# EAGLE design BattleBitsManual (EAGLE 9.3.2)
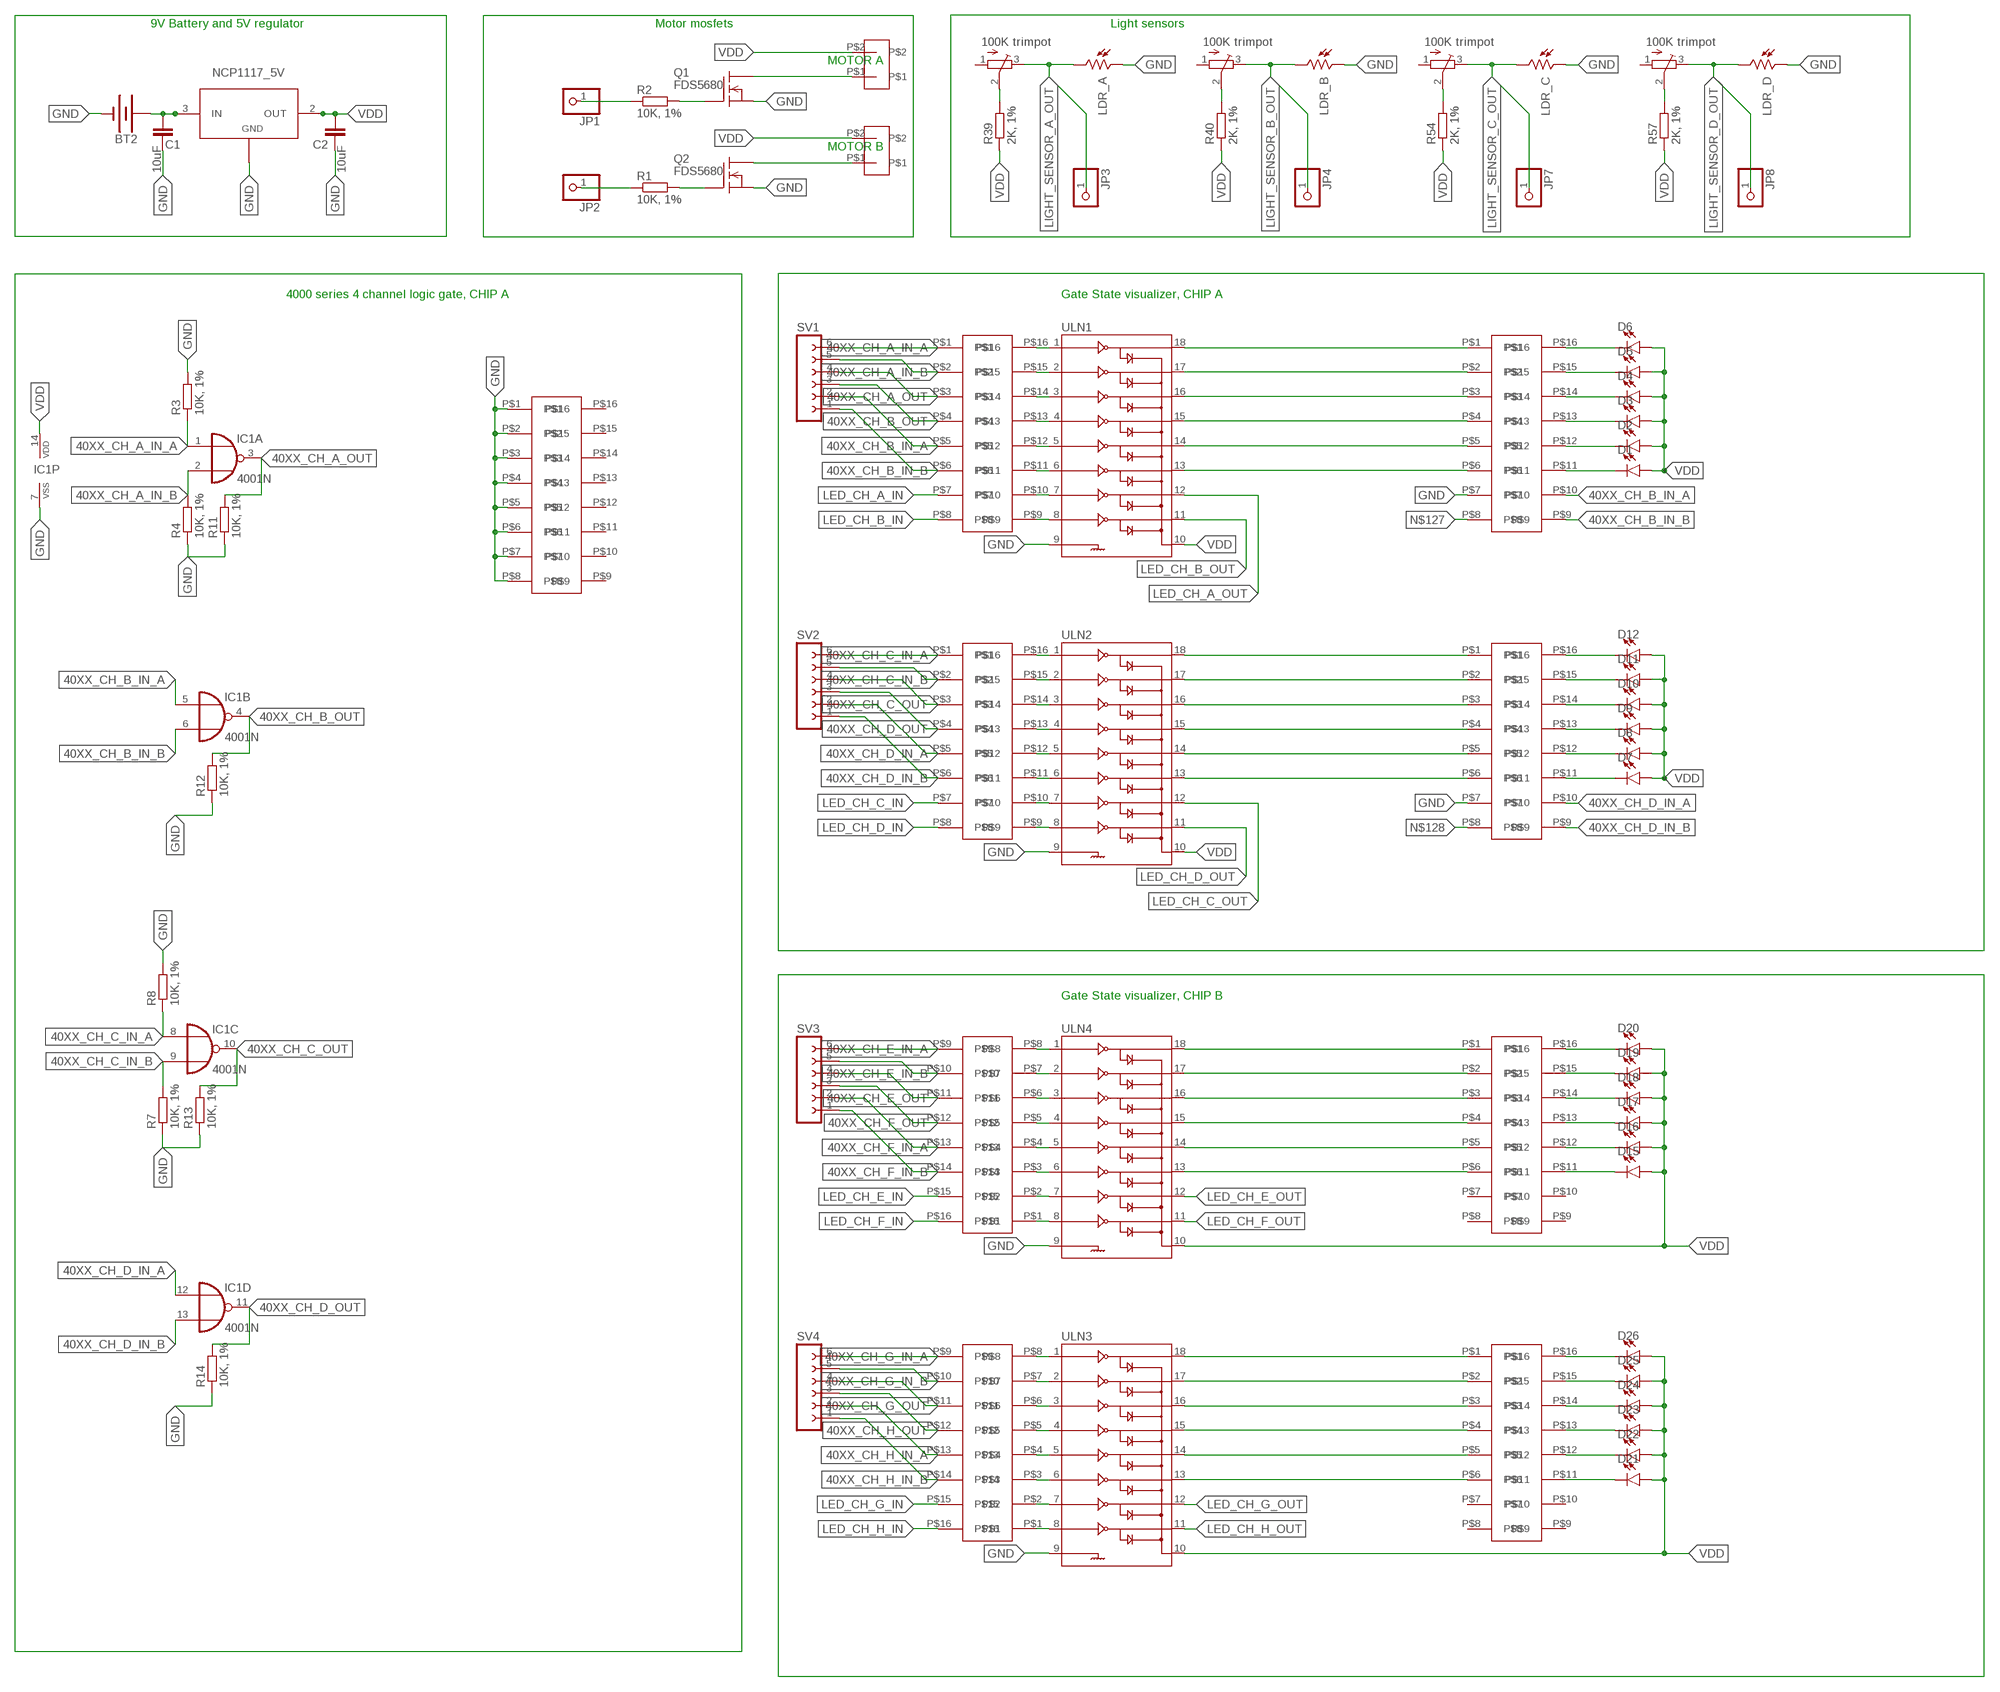
[diagram p0: schematic, sheet 1, part 1 of 3]
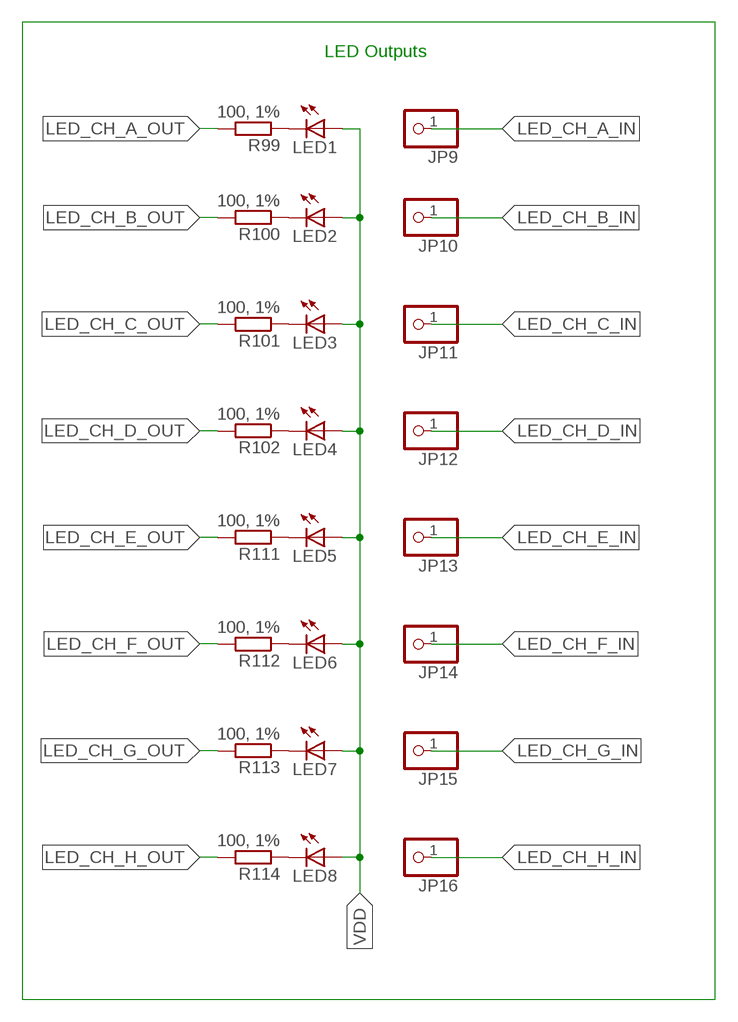
[diagram p1: schematic, sheet 1, part 2 of 3]
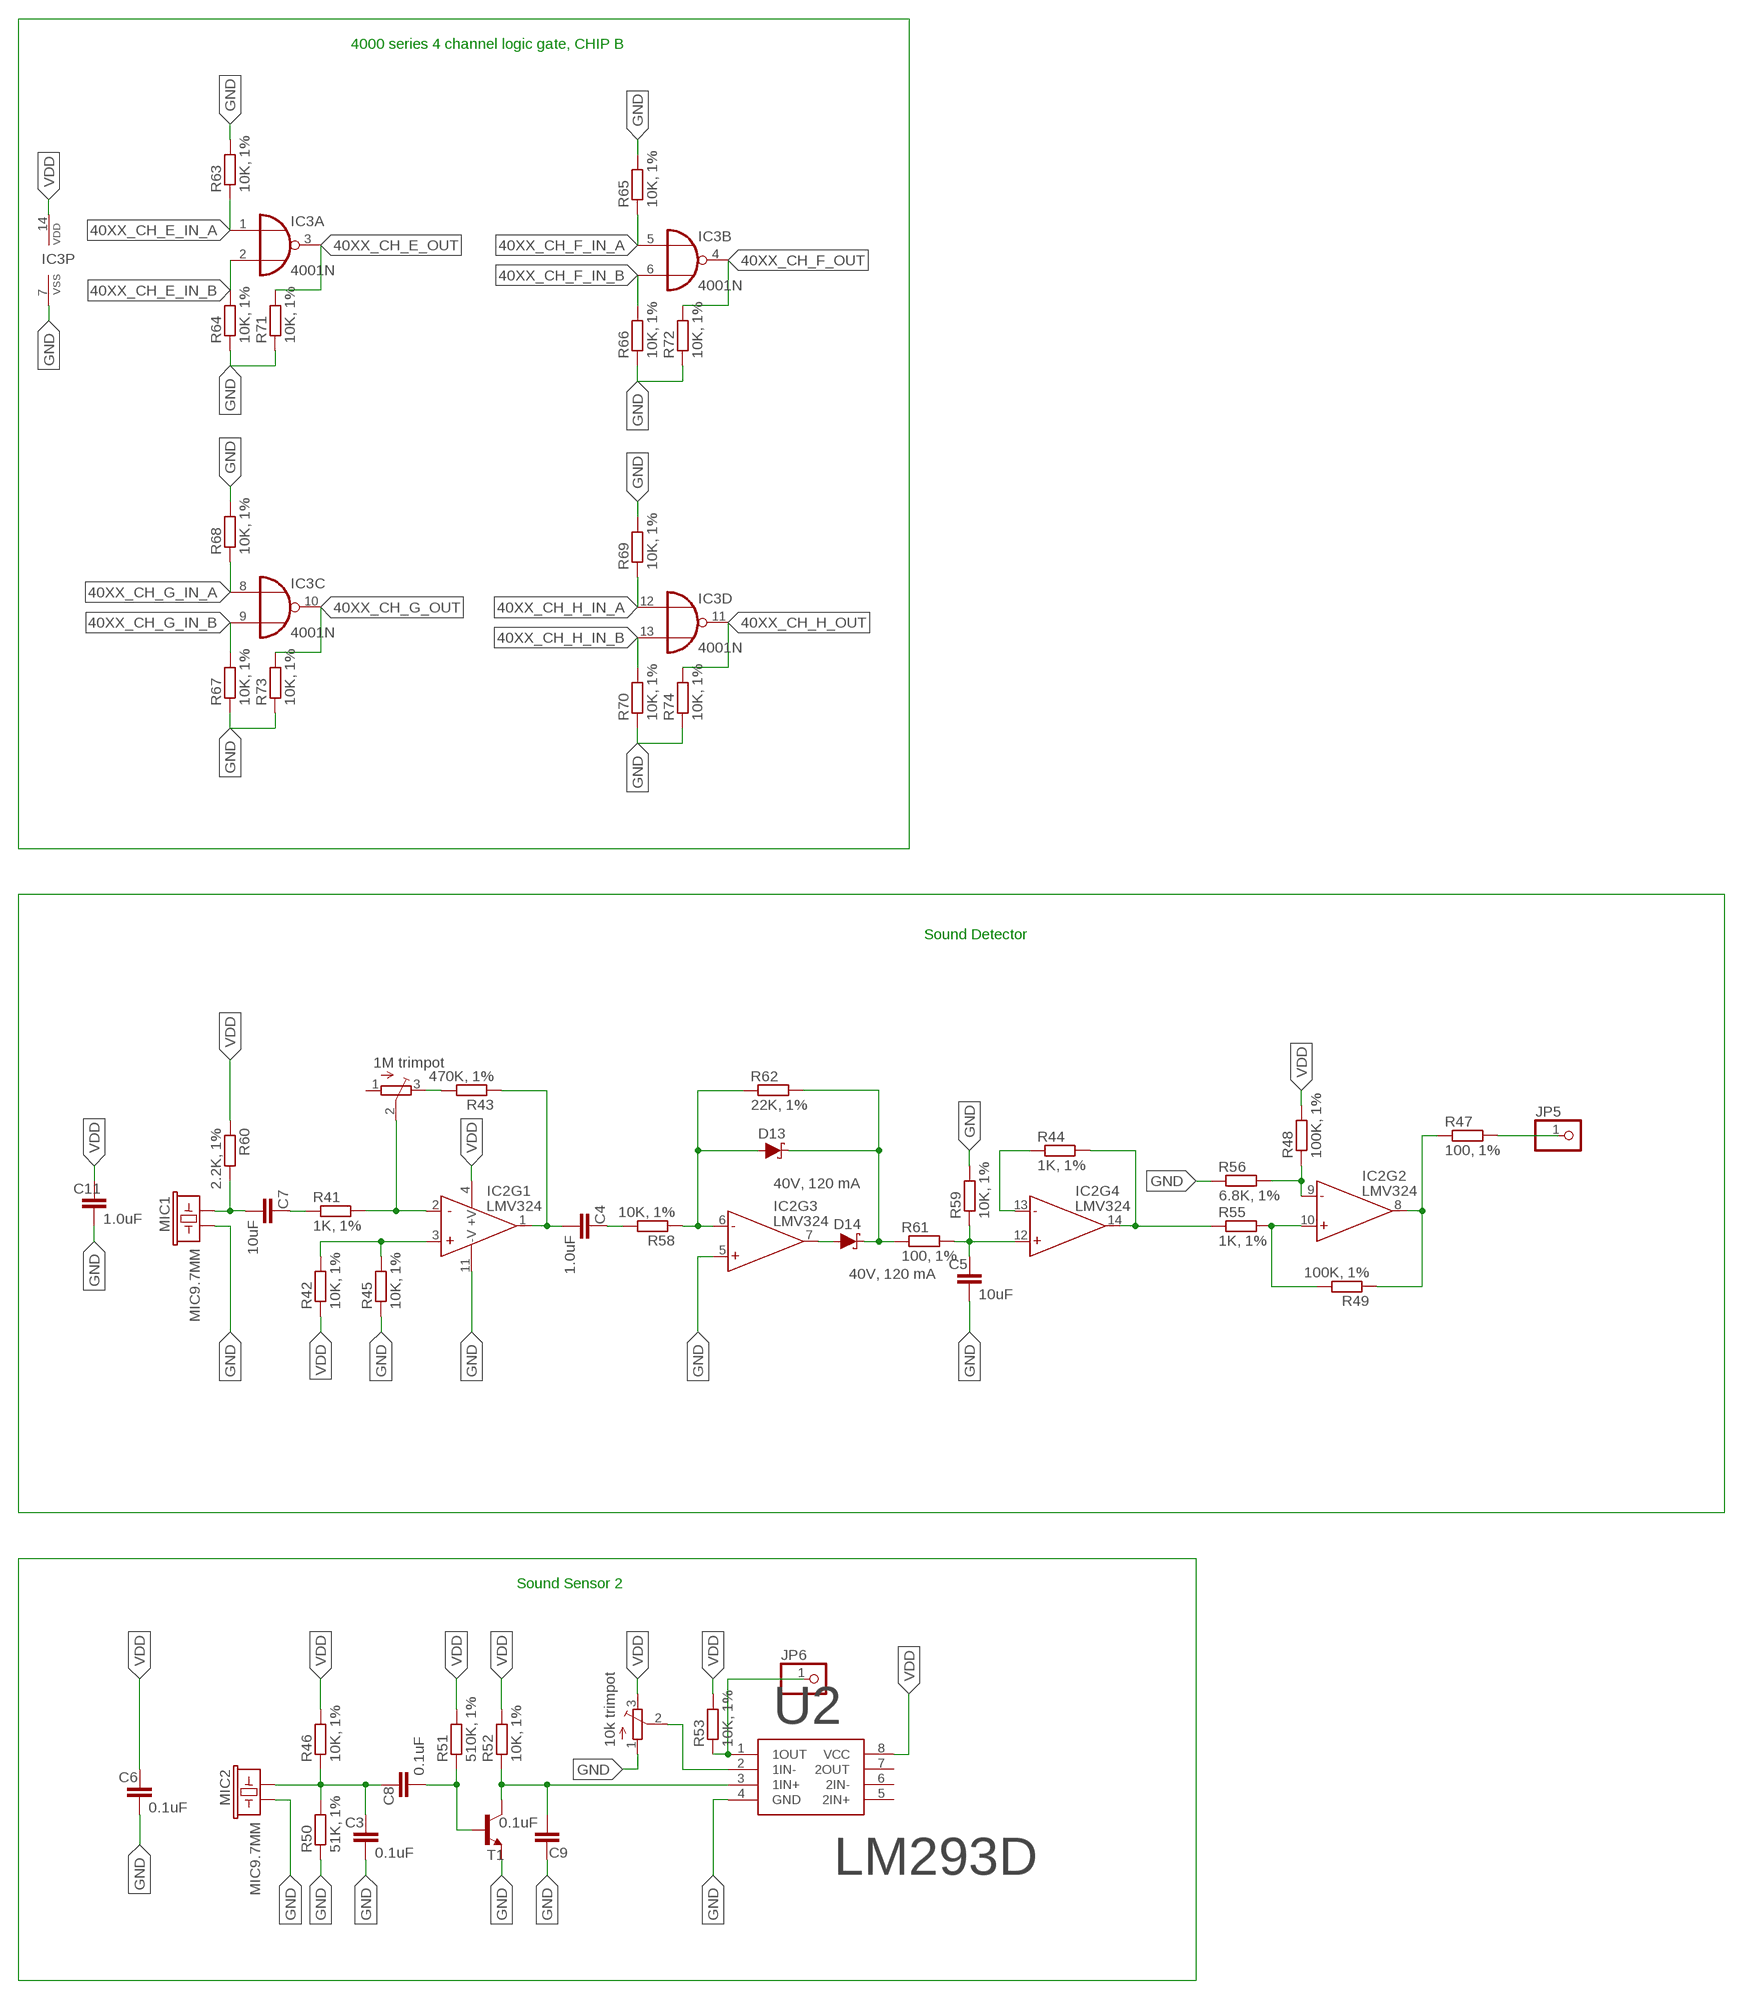
[diagram p2: schematic, sheet 1, part 3 of 3]

## Parts
BT2  BATTERY-9V  [BATTCON_9V]
C1  10uF  C-EUC3216  [C3216]
C2  10uF  C-EUC3216  [C3216]
C3  0.1uF  C-EUC3216  [C3216]
C4  1.0uF  C-EUC3216  [C3216]
C5  10uF  C-EUC3216  [C3216]
C6  0.1uF  C-EUC3216  [C3216]
C7  10uF  C-EUC3216  [C3216]
C8  0.1uF  C-EUC3216  [C3216]
C9  0.1uF  C-EUC3216  [C3216]
C11  1.0uF  C-EUC3216  [C3216]
D1  LED1206  [LED-1206]
D2  LED1206  [LED-1206]
D3  LED1206  [LED-1206]
D4  LED1206  [LED-1206]
D5  LED1206  [LED-1206]
D6  LED1206  [LED-1206]
D7  LED1206  [LED-1206]
D8  LED1206  [LED-1206]
D9  LED1206  [LED-1206]
D10  LED1206  [LED-1206]
D11  LED1206  [LED-1206]
D12  LED1206  [LED-1206]
D13  40V, 120 mA  DIODE-SCHOTTKY-ZLLS500  [SOT23-3]
D14  40V, 120 mA  DIODE-SCHOTTKY-ZLLS500  [SOT23-3]
D15  LED1206  [LED-1206]
D16  LED1206  [LED-1206]
D17  LED1206  [LED-1206]
D18  LED1206  [LED-1206]
D19  LED1206  [LED-1206]
D20  LED1206  [LED-1206]
D21  LED1206  [LED-1206]
D22  LED1206  [LED-1206]
D23  LED1206  [LED-1206]
D24  LED1206  [LED-1206]
D25  LED1206  [LED-1206]
D26  LED1206  [LED-1206]
IC1  4001N  [DIL14]
IC2  LMV324  [SO014]
IC3  4001N  [DIL14]
JP1  PINHD-1X1  [1X01]
JP2  PINHD-1X1  [1X01]
JP3  PINHD-1X1  [1X01]
JP4  PINHD-1X1  [1X01]
JP5  PINHD-1X1  [1X01]
JP6  PINHD-1X1  [1X01]
JP7  PINHD-1X1  [1X01]
JP8  PINHD-1X1  [1X01]
JP9  PINHD-1X1  [1X01]
JP10  PINHD-1X1  [1X01]
JP11  PINHD-1X1  [1X01]
JP12  PINHD-1X1  [1X01]
JP13  PINHD-1X1  [1X01]
JP14  PINHD-1X1  [1X01]
JP15  PINHD-1X1  [1X01]
JP16  PINHD-1X1  [1X01]
LDR_A  V1060_21  [TO-5_V10]
LDR_B  V1060_21  [TO-5_V10]
LDR_C  V1060_21  [TO-5_V10]
LDR_D  V1060_21  [TO-5_V10]
LED1  LED5MM  [LED5MM]
LED2  LED5MM  [LED5MM]
LED3  LED5MM  [LED5MM]
LED4  LED5MM  [LED5MM]
LED5  LED5MM  [LED5MM]
LED6  LED5MM  [LED5MM]
LED7  LED5MM  [LED5MM]
LED8  LED5MM  [LED5MM]
MIC1  MIC9.7MM  [MIC-9.7MM]
MIC2  MIC9.7MM  [MIC-9.7MM]
Q1  FDS5680  [SO-8]
Q2  FDS5680  [SO-8]
R1  10K, 1%  R-EU_R3216  [R3216]
R2  10K, 1%  R-EU_R3216  [R3216]
R3  10K, 1%  R-EU_R3216  [R3216]
R4  10K, 1%  R-EU_R3216  [R3216]
R7  10K, 1%  R-EU_R3216  [R3216]
R8  10K, 1%  R-EU_R3216  [R3216]
R11  10K, 1%  R-EU_R3216  [R3216]
R12  10K, 1%  R-EU_R3216  [R3216]
R13  10K, 1%  R-EU_R3216  [R3216]
R14  10K, 1%  R-EU_R3216  [R3216]
R39  2K, 1%  R-EU_R3216  [R3216]
R40  2K, 1%  R-EU_R3216  [R3216]
R41  1K, 1%  R-EU_R3216  [R3216]
R42  10K, 1%  R-EU_R3216  [R3216]
R43  470K, 1%  R-EU_R3216  [R3216]
R44  1K, 1%  R-EU_R3216  [R3216]
R45  10K, 1%  R-EU_R3216  [R3216]
R46  10K, 1%  R-EU_R3216  [R3216]
R47  100, 1%  R-EU_R3216  [R3216]
R48  100K, 1%  R-EU_R3216  [R3216]
R49  100K, 1%  R-EU_R3216  [R3216]
R50  51K, 1%  R-EU_R3216  [R3216]
R51  510K, 1%  R-EU_R3216  [R3216]
R52  10K, 1%  R-EU_R3216  [R3216]
R53  10K, 1%  R-EU_R3216  [R3216]
R54  2K, 1%  R-EU_R3216  [R3216]
R55  1K, 1%  R-EU_R3216  [R3216]
R56  6.8K, 1%  R-EU_R3216  [R3216]
R57  2K, 1%  R-EU_R3216  [R3216]
R58  10K, 1%  R-EU_R3216  [R3216]
R59  10K, 1%  R-EU_R3216  [R3216]
R60  2.2K, 1%  R-EU_R3216  [R3216]
R61  100, 1%  R-EU_R3216  [R3216]
R62  22K, 1%  R-EU_R3216  [R3216]
R63  10K, 1%  R-EU_R3216  [R3216]
R64  10K, 1%  R-EU_R3216  [R3216]
R65  10K, 1%  R-EU_R3216  [R3216]
R66  10K, 1%  R-EU_R3216  [R3216]
R67  10K, 1%  R-EU_R3216  [R3216]
R68  10K, 1%  R-EU_R3216  [R3216]
R69  10K, 1%  R-EU_R3216  [R3216]
R70  10K, 1%  R-EU_R3216  [R3216]
R71  10K, 1%  R-EU_R3216  [R3216]
R72  10K, 1%  R-EU_R3216  [R3216]
R73  10K, 1%  R-EU_R3216  [R3216]
R74  10K, 1%  R-EU_R3216  [R3216]
R99  100, 1%  R-EU_R3216  [R3216]
R100  100, 1%  R-EU_R3216  [R3216]
R101  100, 1%  R-EU_R3216  [R3216]
R102  100, 1%  R-EU_R3216  [R3216]
R111  100, 1%  R-EU_R3216  [R3216]
R112  100, 1%  R-EU_R3216  [R3216]
R113  100, 1%  R-EU_R3216  [R3216]
R114  100, 1%  R-EU_R3216  [R3216]
SV1  FE06-1  [FE06]
SV2  FE06-1  [FE06]
SV3  FE06-1  [FE06]
SV4  FE06-1  [FE06]
T1  BC808-NPN-SOT23-BEC  [SOT23-BEC]
TM1  100K trimpot  TRIMPOTTC33X  [TC33X]
TM2  100K trimpot  TRIMPOTTC33X  [TC33X]
TM3  1M trimpot  TRIMPOTTC33X  [TC33X]
TM4  10k trimpot  TRIMPOTTC33X  [TC33X]
TM5  100K trimpot  TRIMPOTTC33X  [TC33X]
TM6  100K trimpot  TRIMPOTTC33X  [TC33X]
U1  NCP1117_5V  NCP1117ST33T3G  [SOT-223]
U2  LM293D  [8-SOIC]
U$1  MOTOR  [GEARMOTOR]
U$2  MOTOR  [GEARMOTOR]
U$3  8_RES_ISO_SOIC16  [8_RES_ISO_SOIC16]
U$4  8_RES_ISO_SOIC16  [8_RES_ISO_SOIC16]
U$5  8_RES_ISO_SOIC16  [8_RES_ISO_SOIC16]
U$6  8_RES_ISO_SOIC16  [8_RES_ISO_SOIC16]
U$7  8_RES_ISO_SOIC16  [8_RES_ISO_SOIC16]
U$8  8_RES_ISO_SOIC16  [8_RES_ISO_SOIC16]
U$9  8_RES_ISO_SOIC16  [8_RES_ISO_SOIC16]
U$10  8_RES_ISO_SOIC16  [8_RES_ISO_SOIC16]
U$11  8_RES_ISO_SOIC16  [8_RES_ISO_SOIC16]
ULN1  ULN2803SOICW  [SO18L]
ULN2  ULN2803SOICW  [SO18L]
ULN3  ULN2803SOICW  [SO18L]
ULN4  ULN2803SOICW  [SO18L]

## Nets
40XX_CH_A_IN_A [SIGNAL]: IC1.1(A:I0) R3.1 SV1.6 U$9.P$1
40XX_CH_A_IN_B [SIGNAL]: IC1.2(A:I1) R4.2 SV1.5 U$9.P$2
40XX_CH_A_OUT [SIGNAL]: IC1.3(A:O) R11.2 SV1.4 U$9.P$3
40XX_CH_B_IN_A [SIGNAL]: IC1.5(B:I0) SV1.2 U$3.P$10 U$9.P$5
40XX_CH_B_IN_B [SIGNAL]: IC1.6(B:I1) SV1.1 U$3.P$9 U$9.P$6
40XX_CH_B_OUT [SIGNAL]: IC1.4(B:O) R12.2 SV1.3 U$9.P$4
40XX_CH_C_IN_A [SIGNAL]: IC1.8(C:I0) R8.1 SV2.6 U$4.P$1
40XX_CH_C_IN_B [SIGNAL]: IC1.9(C:I1) R7.2 SV2.5 U$4.P$2
40XX_CH_C_OUT [SIGNAL]: IC1.10(C:O) R13.2 SV2.4 U$4.P$3
40XX_CH_D_IN_A [SIGNAL]: IC1.12(D:I0) SV2.2 U$4.P$5 U$7.P$10
40XX_CH_D_IN_B [SIGNAL]: IC1.13(D:I1) SV2.1 U$4.P$6 U$7.P$9
40XX_CH_D_OUT [SIGNAL]: IC1.11(D:O) R14.2 SV2.3 U$4.P$4
40XX_CH_E_IN_A [SIGNAL]: IC3.1(A:I0) R63.1 SV3.6 U$5.P$9
40XX_CH_E_IN_B [SIGNAL]: IC3.2(A:I1) R64.2 SV3.5 U$5.P$10
40XX_CH_E_OUT [SIGNAL]: IC3.3(A:O) R71.2 SV3.4 U$5.P$11
40XX_CH_F_IN_A [SIGNAL]: IC3.5(B:I0) R65.1 SV3.2 U$5.P$13
40XX_CH_F_IN_B [SIGNAL]: IC3.6(B:I1) R66.2 SV3.1 U$5.P$14
40XX_CH_F_OUT [SIGNAL]: IC3.4(B:O) R72.2 SV3.3 U$5.P$12
40XX_CH_G_IN_A [SIGNAL]: IC3.8(C:I0) R68.1 SV4.6 U$6.P$9
40XX_CH_G_IN_B [SIGNAL]: IC3.9(C:I1) R67.2 SV4.5 U$6.P$10
40XX_CH_G_OUT [SIGNAL]: IC3.10(C:O) R73.2 SV4.4 U$6.P$11
40XX_CH_H_IN_A [SIGNAL]: IC3.12(D:I0) R69.1 SV4.2 U$6.P$13
40XX_CH_H_IN_B [SIGNAL]: IC3.13(D:I1) R70.2 SV4.1 U$6.P$14
40XX_CH_H_OUT [SIGNAL]: IC3.11(D:O) R74.2 SV4.3 U$6.P$12
AMPENV [SIGNAL]: IC2.14(OUT) R44.2 R55.1
GND: BT2.- C1.1 C2.1 C3.2 C5.2 C6.2 C9.1 C11.2 IC1.7(P:VSS) IC2.5(+IN) IC2.11(-V) IC3.7(P:VSS) LDR_A.1 LDR_B.1 LDR_C.1 LDR_D.1 MIC1.2 MIC2.2 Q1.1(S) Q1.2(S) Q1.3(S) Q2.1(S) Q2.2(S) Q2.3(S) R3.2 R4.1 R7.1 R8.2 R11.1 R12.1 R13.1 R14.1 R45.1 R50.1 R56.1 R59.2 R63.2 R64.1 R65.2 R66.1 R67.1 R68.2 R69.2 R70.1 R71.1 R72.1 R73.1 R74.1 T1.E TM4.1(A) U1.1(ADJ/GND) U2.4(GND) U$3.P$7 U$7.P$7 U$8.P$1 U$8.P$2 U$8.P$3 U$8.P$4 U$8.P$5 U$8.P$6 U$8.P$7 U$8.P$8 ULN1.9 ULN2.9 ULN3.9 ULN4.9
LED_CH_A_IN [SIGNAL]: JP9.1 U$9.P$7
LED_CH_A_OUT: R99.2 ULN1.12
LED_CH_B_IN [SIGNAL]: JP10.1 U$9.P$8
LED_CH_B_OUT: R100.2 ULN1.11
LED_CH_C_IN [SIGNAL]: JP11.1 U$4.P$7
LED_CH_C_OUT: R101.2 ULN2.12
LED_CH_D_IN [SIGNAL]: JP12.1 U$4.P$8
LED_CH_D_OUT: R102.2 ULN2.11
LED_CH_E_IN [SIGNAL]: JP13.1 U$5.P$15
LED_CH_E_OUT: R111.2 ULN4.12
LED_CH_F_IN [SIGNAL]: JP14.1 U$5.P$16
LED_CH_F_OUT: R112.2 ULN4.11
LED_CH_G_IN [SIGNAL]: JP15.1 U$6.P$15
LED_CH_G_OUT: R113.2 ULN3.12
LED_CH_H_IN [SIGNAL]: JP16.1 U$6.P$16
LED_CH_H_OUT: R114.2 ULN3.11
LIGHT_SENSOR_A_OUT [SIGNAL]: JP3.1 LDR_A.2 TM1.3(E)
LIGHT_SENSOR_B_OUT [SIGNAL]: JP4.1 LDR_B.2 TM2.3(E)
LIGHT_SENSOR_C_OUT [SIGNAL]: JP7.1 LDR_C.2 TM5.3(E)
LIGHT_SENSOR_D_OUT [SIGNAL]: JP8.1 LDR_D.2 TM6.3(E)
MOTOR_A-: Q1.5(D) Q1.6(D) Q1.7(D) Q1.8(D) U$1.P$1
MOTOR_B-: Q2.5(D) Q2.6(D) Q2.7(D) Q2.8(D) U$2.P$1
N$ [SIGNAL]: C4.2 IC2.1(OUT) R43.1
N$5 [SIGNAL]: U$9.P$16 ULN1.1
N$6 [SIGNAL]: Q1.4(G) R2.2
N$7 [SIGNAL]: Q2.4(G) R1.2
N$8 [SIGNAL]: U$9.P$15 ULN1.2
N$9 [SIGNAL]: U$9.P$14 ULN1.3
N$10 [SIGNAL]: U$9.P$13 ULN1.4
N$11 [SIGNAL]: U$9.P$12 ULN1.5
N$12 [SIGNAL]: U$9.P$11 ULN1.6
N$13 [SIGNAL]: U$4.P$16 ULN2.1
N$14 [SIGNAL]: U$4.P$15 ULN2.2
N$15 [SIGNAL]: U$4.P$14 ULN2.3
N$16 [SIGNAL]: U$4.P$13 ULN2.4
N$17 [SIGNAL]: U$4.P$12 ULN2.5
N$18 [SIGNAL]: U$4.P$11 ULN2.6
N$19: U$3.P$1 ULN1.18
N$20: D6.C U$3.P$16
N$21: U$3.P$2 ULN1.17
N$22: D5.C U$3.P$15
N$23: U$3.P$3 ULN1.16
N$24: D4.C U$3.P$14
N$25: U$3.P$4 ULN1.15
N$26: D3.C U$3.P$13
N$27: U$3.P$5 ULN1.14
N$28: D2.C U$3.P$12
N$29: U$3.P$6 ULN1.13
N$30: D1.C U$3.P$11
N$31: U$7.P$1 ULN2.18
N$32: U$7.P$3 ULN2.16
N$33: U$7.P$4 ULN2.15
N$34: U$7.P$5 ULN2.14
N$35: U$7.P$6 ULN2.13
N$36: D12.C U$7.P$16
N$37: D11.C U$7.P$15
N$38: U$7.P$2 ULN2.17
N$39: D10.C U$7.P$14
N$40: D9.C U$7.P$13
N$41: D8.C U$7.P$12
N$42: D7.C U$7.P$11
N$44 [SIGNAL]: R39.2 TM1.2(S)
N$45 [SIGNAL]: R40.2 TM2.2(S)
N$46 [SIGNAL]: C7.2 MIC1.1 R60.2
N$47 [SIGNAL]: IC2.3(+IN) R42.2 R45.2
N$48 [SIGNAL]: IC2.2(-IN) R41.2 TM3.2(S)
N$49 [SIGNAL]: C7.1 R41.1
N$50 [SIGNAL]: C4.1 R58.2
N$51 [SIGNAL]: D13.1(A) IC2.6(-IN) R58.1 R62.1
N$52 [SIGNAL]: D14.1(A) IC2.7(OUT)
N$53 [SIGNAL]: D13.3(C) D14.3(C) R61.1 R62.2
N$54 [SIGNAL]: C5.1 IC2.12(+IN) R59.1 R61.2
N$55 [SIGNAL]: IC2.13(-IN) R44.1
N$56 [SIGNAL]: IC2.9(-IN) R48.1 R56.2
N$57 [SIGNAL]: IC2.10(+IN) R49.2 R55.2
N$58 [SIGNAL]: IC2.8(OUT) R47.1 R49.1
N$59 [SIGNAL]: R43.2 TM3.3(E)
N$60 [SIGNAL]: C3.1 C8.1 MIC2.1 R46.1 R50.2
N$62 [SIGNAL]: C8.2 R51.1 T1.B
N$63 [SIGNAL]: C9.2 R52.1 T1.C U2.3(1IN+)
N$64 [SIGNAL]: TM4.2(S) U2.2(1IN-)
N$65 [SIGNAL]: JP6.1 R53.1 U2.1(1OUT)
N$67 [SIGNAL]: JP1.1 R2.1
N$68 [SIGNAL]: JP2.1 R1.1
N$69 [SIGNAL]: JP5.1 R47.2
N$70 [SIGNAL]: R54.2 TM5.2(S)
N$71 [SIGNAL]: R57.2 TM6.2(S)
N$74 [SIGNAL]: U$5.P$8 ULN4.1
N$75 [SIGNAL]: U$5.P$7 ULN4.2
N$76 [SIGNAL]: U$5.P$6 ULN4.3
N$77 [SIGNAL]: U$5.P$5 ULN4.4
N$78 [SIGNAL]: U$5.P$4 ULN4.5
N$79 [SIGNAL]: U$5.P$3 ULN4.6
N$80 [SIGNAL]: U$6.P$8 ULN3.1
N$81 [SIGNAL]: U$6.P$7 ULN3.2
N$82 [SIGNAL]: U$6.P$6 ULN3.3
N$83 [SIGNAL]: U$6.P$5 ULN3.4
N$84 [SIGNAL]: U$6.P$4 ULN3.5
N$85 [SIGNAL]: U$6.P$3 ULN3.6
N$86: D20.C U$10.P$16
N$87: D19.C U$10.P$15
N$88: D18.C U$10.P$14
N$89: D17.C U$10.P$13
N$90: D16.C U$10.P$12
N$91: D15.C U$10.P$11
N$92: D26.C U$11.P$16
N$93: D25.C U$11.P$15
N$94: D24.C U$11.P$14
N$95: D23.C U$11.P$13
N$96: D22.C U$11.P$12
N$97: D21.C U$11.P$11
N$98: U$10.P$1 ULN4.18
N$99: U$10.P$2 ULN4.17
N$100: U$10.P$3 ULN4.16
N$101: U$10.P$4 ULN4.15
N$102: U$10.P$5 ULN4.14
N$103: U$10.P$6 ULN4.13
N$104: U$11.P$1 ULN3.18
N$105: U$11.P$2 ULN3.17
N$106: U$11.P$3 ULN3.16
N$107: U$11.P$4 ULN3.15
N$108: U$11.P$5 ULN3.14
N$109: U$11.P$6 ULN3.13
N$111: LED1.K(C) R99.1
N$112: LED2.K(C) R100.1
N$113: LED3.K(C) R101.1
N$114: LED4.K(C) R102.1
N$115 [SIGNAL]: U$9.P$10 ULN1.7
N$116 [SIGNAL]: U$9.P$9 ULN1.8
N$117 [SIGNAL]: U$4.P$10 ULN2.7
N$118 [SIGNAL]: U$4.P$9 ULN2.8
N$119 [SIGNAL]: U$5.P$2 ULN4.7
N$120 [SIGNAL]: U$5.P$1 ULN4.8
N$121 [SIGNAL]: U$6.P$2 ULN3.7
N$122 [SIGNAL]: U$6.P$1 ULN3.8
N$123: LED5.K(C) R111.1
N$124: LED6.K(C) R112.1
N$125: LED7.K(C) R113.1
N$126: LED8.K(C) R114.1
N$127: U$3.P$8
N$128: U$7.P$8
VBAT: BT2.+ C1.2 U1.3(IN)
VDD: C2.2 C6.1 C11.1 D1.A D2.A D3.A D4.A D5.A D6.A D7.A D8.A D9.A D10.A D11.A D12.A D15.A D16.A D17.A D18.A D19.A D20.A D21.A D22.A D23.A D24.A D25.A D26.A IC1.14(P:VDD) IC2.4(+V) IC3.14(P:VDD) LED1.A LED2.A LED3.A LED4.A LED5.A LED6.A LED7.A LED8.A R39.1 R40.1 R42.1 R46.2 R48.2 R51.2 R52.2 R53.2 R54.1 R57.1 R60.1 TM4.3(E) U1.2(OUT) U1.4 U2.8(VCC) U$1.P$2 U$2.P$2 ULN1.10 ULN2.10 ULN3.10 ULN4.10
Unconnected: TM1.1(A) TM2.1(A) TM3.1(A) TM5.1(A) TM6.1(A) U2.5(2IN+) U2.6(2IN-) U2.7(2OUT) U$8.P$9 U$8.P$10 U$8.P$11 U$8.P$12 U$8.P$13 U$8.P$14 U$8.P$15 U$8.P$16 U$10.P$7 U$10.P$8 U$10.P$9 U$10.P$10 U$11.P$7 U$11.P$8 U$11.P$9 U$11.P$10

## Notes on the sheet
- 9V Battery and 5V regulator | Motor mosfets | Light sensors
- MOTOR A
- MOTOR B
- 4000 series 4 channel logic gate, CHIP A | Gate State visualizer, CHIP A | LED Outputs
- Gate State visualizer, CHIP B
- 4000 series 4 channel logic gate, CHIP B
- Sound Detector
- Sound Sensor 2

## Library data of the parts
BT2 = SparkFun-Batteries:BATTERY: Battery - Single Cell A variety of battery chemistries, sizes, and footprints. Device List: 20MM_PTH - Coin Cell Battery Holder - 20mm (PTH) <https://www.sparkfun.com/products/783> 6.8MM_PTH - Coin Cell Battery Holder - 6.8MM(SMD) <https://www.digikey.com/product-detail/en/seiko-instruments/MS621FE-FL11E/728-1057-ND/1889208?WT.srch=1&gclid=CNOQ5a6LzdQCFZS2wAodXCkE0g> 12MM_SMD - Coin Cell Battery Holder - 12mm (SMD) <https://www.sparkfun.com/products/10592> 12MM_PTH - Coin Cell Battery Holder - 12mm (PTH) <https://www.sparkfun.com/products/7948> 20MM_SMD - 20mm Coin Cell Battery Holder (SMD) (2 legs) Used on the Big Time Watch Kit <https://www.sparkfun.com/products/11734> 20MM_SMD_4LEGS - Coin Cell Battery Holder - 20mm (SMD) <https://www.sparkfun.com/products/11892> 20MM_SMD_4LEGS_OVERPASTE - Coin Cell Battery Holder - 20mm (SMD) <https://www.sparkfun.com/products/11892> (Over-paste on the legs) 24.5MM_PTH - Coin Cell Battery Holder - 24.5mm (PTH) <https://www.sparkfun.com/products/8863> 9V - 9V Battery Holder - PC Mount Used on the SparkFun SparkPunk Sound Kit <https://www.sparkfun.com/products/11177> and SparkFun SparkPunk Sequencer Kit <https://www.sparkfun.com/products/12707> 18650 - Battery Holder - 18650 (PTH) <https://www.sparkfun.com/products/13113> AA - Battery Holder - 1xAA (PTH) <https://www.sparkfun.com/products/7949> AAA - Battery Holder - 1xAAA (PTH) <https://www.sparkfun.com/products/12718> AA_KIT - Battery Holder - 1xAA (PTH) <https://www.sparkfun.com/products/7949> Special kit package - pads only have exposed copper on one side of the board. AAA_KIT - Battery Holder - 1xAAA (PTH) <https://www.sparkfun.com/products/12718> Special kit package - pads only have exposed copper on one side of the board.; PROD_ID: BATT-10855
C1-C9 C11 = rcl:C-EU: CAPACITOR, European symbol; SPICEPREFIX: C
D1-D12 D15-D26 = SparkFun-LED:LED: LED (Generic) Standard schematic elements and footprints for 5mm, 3mm, 1206, and 0603 sized LEDs. Generic LEDs with no color specified.
D13 D14 = SparkFun-DiscreteSemi:DIODE-SCHOTTKY: Schottky diode A Schottky diode is a semiconductor diode which has a low forward voltage drop and a very fast switching action.; PROD_ID: DIO-08411; VALUE: 700mA/40V/533mV
IC1 IC3 = 40xx:4001: Quad 2-input NOR
IC2 = SparkFun-AnalogIC:LMV324: Jellybean quad op-amp; PROD_ID: IC-08227
JP1-JP16 = adafruit:PINHD-1X1: Pin header 1x1 for 0.1" spacing With round pins
LDR_A LDR_B LDR_C LDR_D = photo-elements:?1060*: Sensor Street Light control Source: http://optoelectronics.perkinelmer.com/content/Datasheets/DTS_PhotocellsB1060.pdf
LED1-LED8 = adafruit:LED: LED OSRAM: - CHIPLED LG R971, LG N971, LY N971, LG Q971, LY Q971, LO R971, LY R971 LH N974, LH R974 LS Q976, LO Q976, LY Q976 LO Q996 - Hyper CHIPLED LW Q18S LB Q993, LB Q99A, LB R99A - SideLED LS A670, LO A670, LY A670, LG A670, LP A670 LB A673, LV A673, LT A673, LW A673 LH A674 LY A675 LS A676, LA A676, LO A676, LY A676, LW A676 LS A679, LY A679, LG A679 - Hyper Micro SIDELED® LS Y876, LA Y876, LO Y876, LY Y876 LT Y87S - SmartLED LW L88C, LW L88S LB L89C, LB L89S, LG L890 LS L89K, LO L89K, LY L89K LS L896, LA L896, LO L896, LY L896 - TOPLED LS T670, LO T670, LY T670, LG T670, LP T670 LSG T670, LSP T670, LSY T670, LOP T670, LYG T670 LG T671, LOG T671, LSG T671 LB T673, LV T673, LT T673, LW T673 LH T674 LS T676, LA T676, LO T676, LY T676, LB T676, LH T676, LSB T676, LW T676 LB T67C, LV T67C, LT T67C, LS T67K, LO T67K, LY T67K, LW E67C LS E67B, LA E67B, LO E67B, LY E67B, LB E67C, LV E67C, LT E67C LW T67C LS T679, LY T679, LG T679 LS T770, LO T770, LY T770, LG T770, LP T770 LB T773, LV T773, LT T773, LW T773 LH T774 LS E675, LA E675, LY E675, LS T675 LS T776, LA T776, LO T776, LY T776, LB T776 LHGB T686 LT T68C, LB T68C - Hyper Mini TOPLED® LB M676 - Mini TOPLED Santana® LG M470 LS M47K, LO M47K, LY M47K Source: http://www.osram.convergy.de/
MIC1 MIC2 = SparkFun-Sensors:MIC: Omni-directional electret microphone. 9.7mm standard diameter.; PROD_ID: COMP-08856
Q1 Q2 = transistor-fet:FDS5680: 60V N-Channel PowerTrench TM MOSFET FAIRCHILD FDS5680.pdf
R1-R4 R7 R8 R11-R14 R39-R74 R99-R102 R111-R114 = rcl:R-EU_: RESISTOR, European symbol; SPICEPREFIX: R
SV1-SV4 = con-lsta:FE06-1: FEMALE HEADER; OC_FARNELL: unknown; OC_NEWARK: unknown
T1 = DC_LOAD_AU:*-NPN-: NPN Transistror BF959 corrected 2008.03.06
TM1-TM6 = adafruit:TRIMPOT: SMT trimmer potentiometer part number TC33X http://www.ladyada.net/library/eagle
U1 = IC:NCP1117ST33T3G: IC REG LINEAR 3.3V 1A SOT223 Manufacturer's datasheet <https://www.onsemi.com/pub/Collateral/NCP1117-D.PDF>; CREATED_BY: PCBLayout.com; DIGIKEY_PART_NUMBER: NCP1117ST33T3GOSTR-ND; MANUFACTURER: ON Semiconductor; MPN: NCP1117ST33T3G; PACKAGE: SOT-223
U2 = IC:LM293D: IC COMPARATOR DIFF DUAL 8SOIC Manufacturer's datasheet <http://www.ti.com/general/docs/suppproductinfo.tsp?distId=10&gotoUrl=http%3A%2F%2Fwww.ti.com%2Flit%2Fgpn%2Flm293>; CREATED_BY: PCBLayout.com; DIGIKEY_PART_NUMBER: 296-9531-5-ND; MANUFACTURER: Texas Instruments; MPN: LM293D; PACKAGE: 8-SOIC
U$1 U$2 = gearmotor:MOTOR
U$3-U$11 = resistorArrayBus:8_RES_ISO_SOIC16
ULN1-ULN4 = SparkFun-IC-Special-Function:ULN2803: Darlington Driver(IC-07959, low stock) ULN2803 Darlington array. 500mA max per channel, 8-channel package. Spark Fun Electronics SKU : COM-00312

## Net classes
0 PWR: width 0.305 mm, drill 0.3 mm, clearance 0.152 mm
1 SIGNAL: width 0.152 mm, drill 0.3 mm, clearance 0.152 mm

## Board
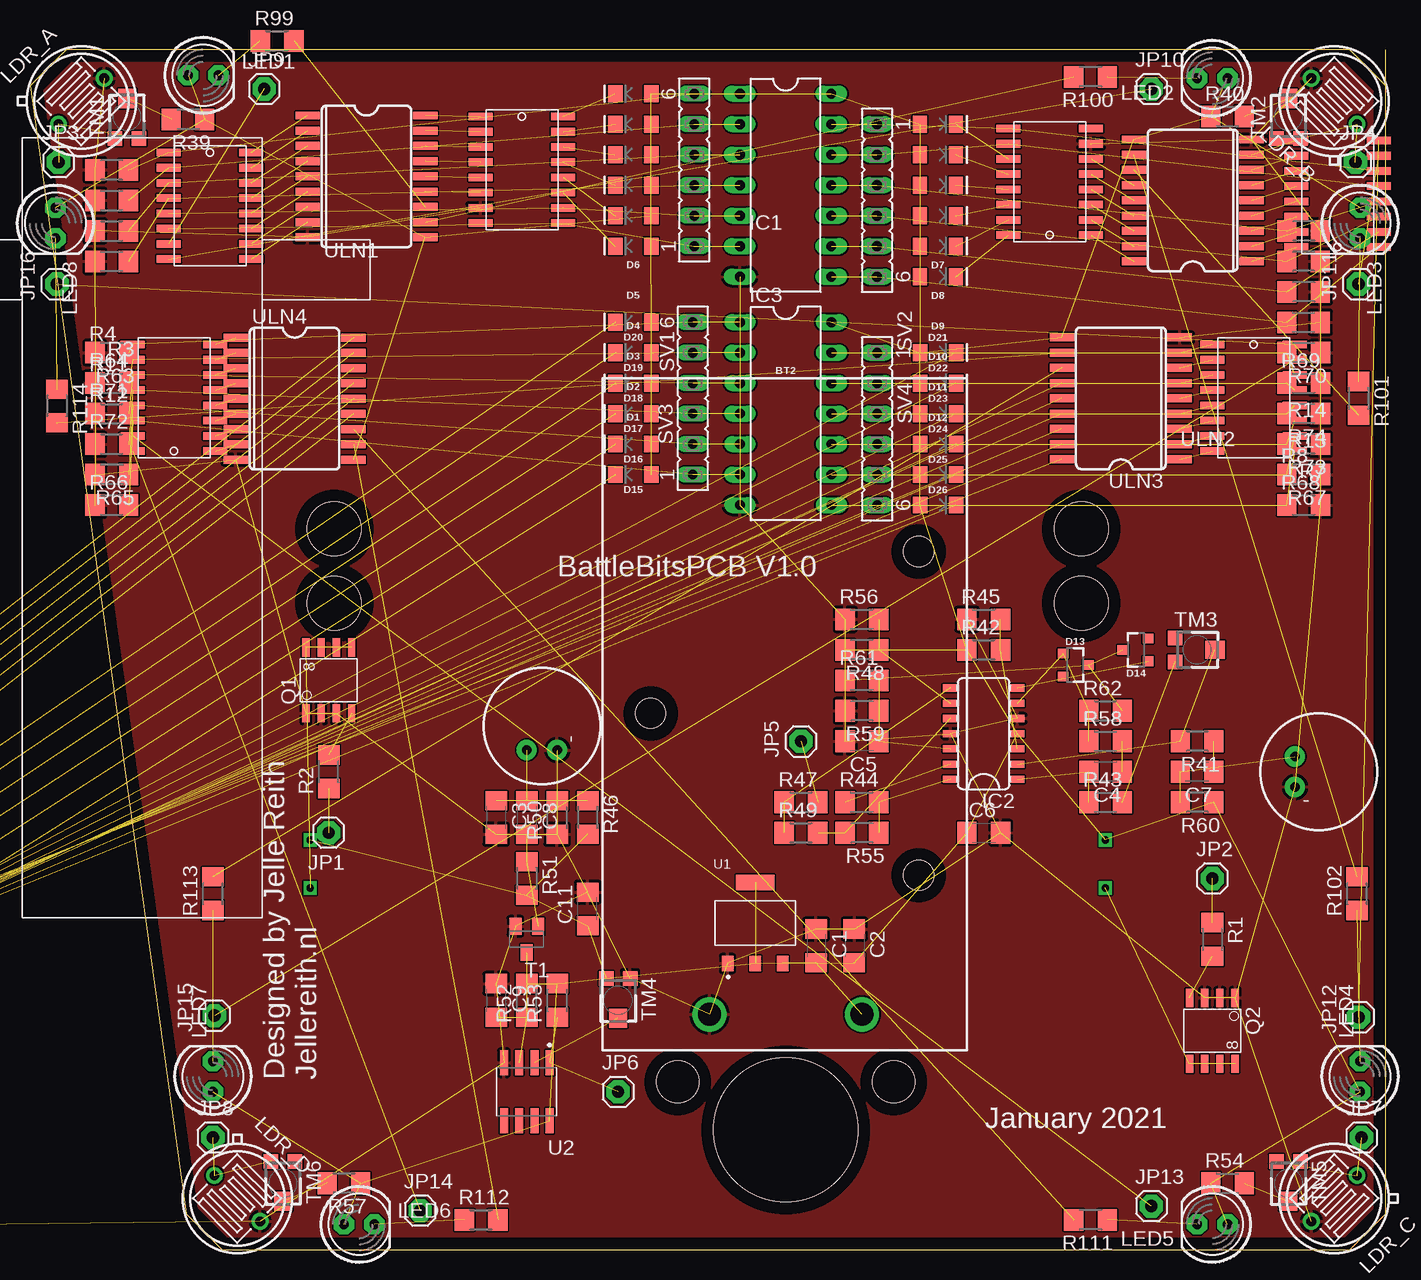
[diagram p3: board, top side]
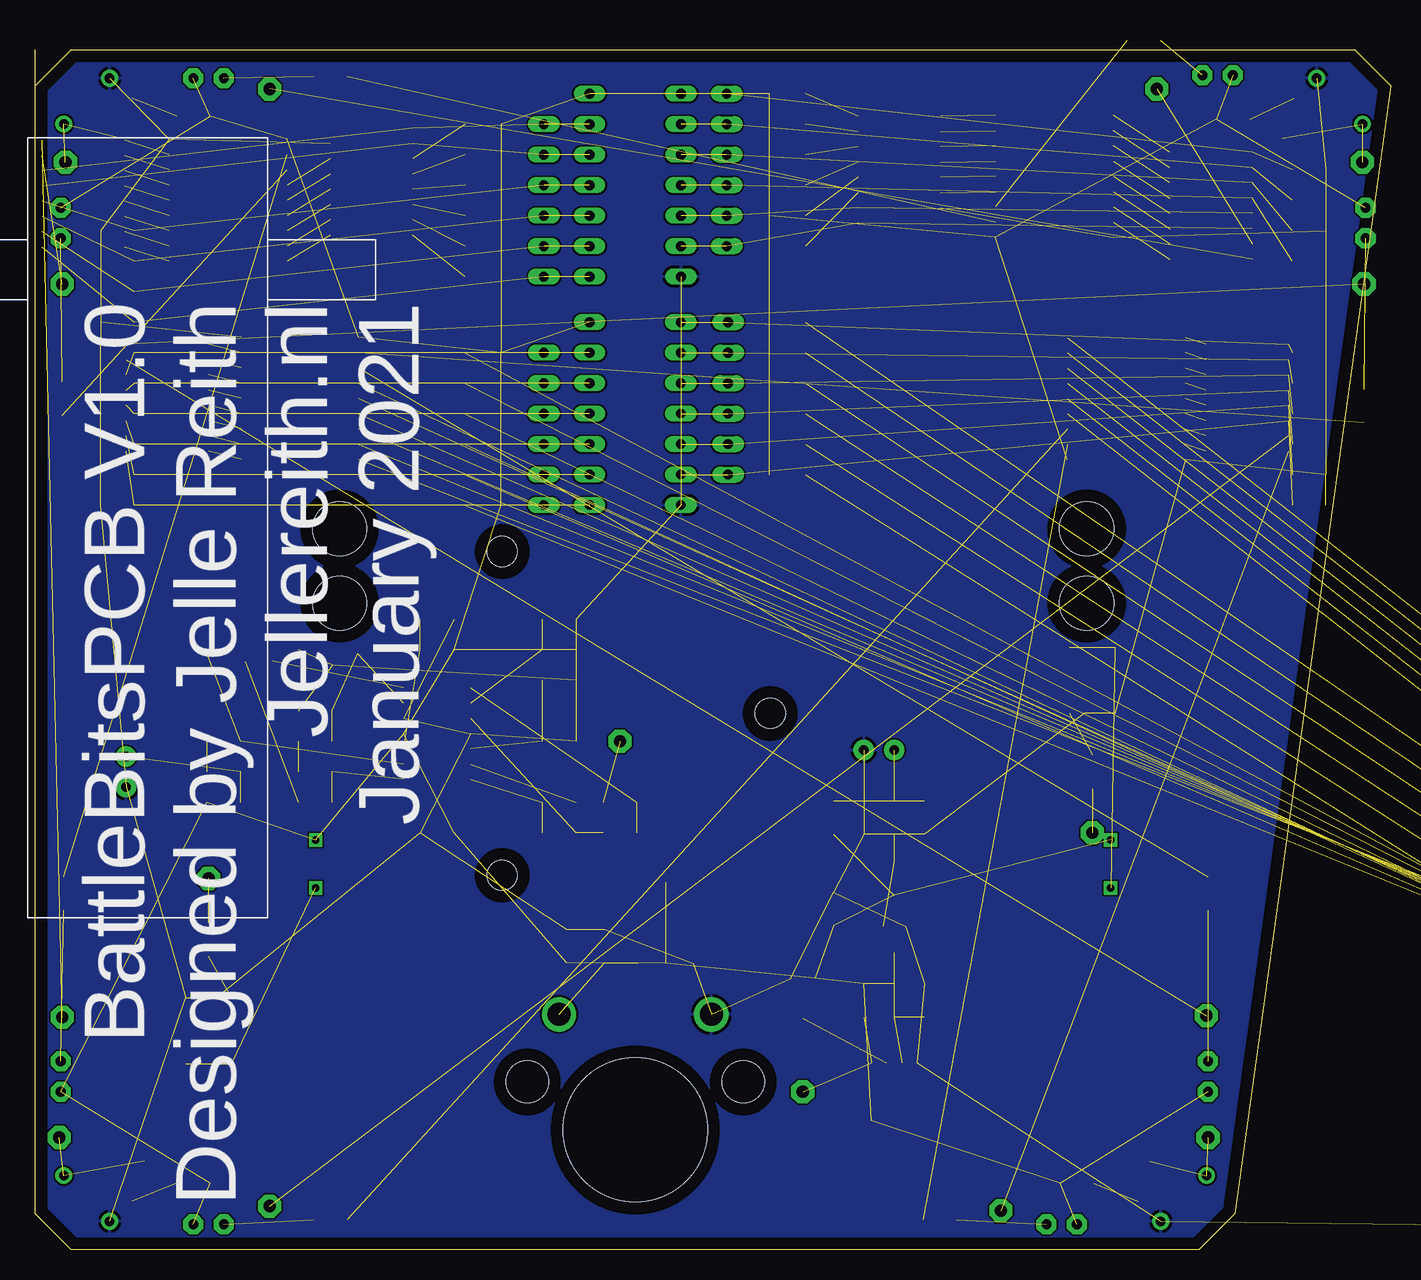
[diagram p4: board, bottom side, seen from below]

Size 113 x 100 mm. Coordinates in mm from the lower left corner, seen from the top.
Outline: 113,97 113,3 110,0 16,0 13,3 0,97 3,100 110,100 113,97
Outline: 113,97 113,100
Copper layers (1*16): Top 0.035mm / dielectric 1.5mm / Bottom 0.035mm
Design rules "default *": minimum track width 6mil, minimum drill 0.35mm, track to track 6mil, track to pad 6mil, pad to pad 6mil, via to via 6mil, smd to smd 6mil, copper to edge 40mil, drill to drill 6mil, minimum pad ring 10mil, minimum via ring 8mil, stop-mask expansion 4mil, vias tented up to drill 0mil, thermal gap 10mil
Holes 12 mm at 63,10
Holes 3.5 mm at 72,14 54,14

### Footprints (pad centres in the part's own frame; a part is rotated, then mirrored left to right if it is on the bottom)
BATTCON_9V = drill 1.905: + 0,0; - 0,-12.7 | hole 2.5: -38.57,4.74; -25.09,-17.61; -11.6,4.74
C3216 = smd 1.6 x 1.8: 1 -1.4,0; 2 1.4,0
LED-1206 = smd 1.2 x 1.4: A -1.5,0; C 1.5,0
SOT23-3 = smd 0.8 x 0.9: 1 -0.95,-1; 2 0.95,-1; 3 0,1.1
DIL14 = drill 0.813 long: 1 -7.62,-3.81; 2 -5.08,-3.81; 3 -2.54,-3.81; 4 0,-3.81; 5 2.54,-3.81; 6 5.08,-3.81; 7 7.62,-3.81; 8 7.62,3.81; 9 5.08,3.81; 10 2.54,3.81; 11 0,3.81; 12 -2.54,3.81; 13 -5.08,3.81; 14 -7.62,3.81
SO014 = smd 0.6 x 1.2: 1 -3.175,-2.8; 2 -1.905,-2.8; 3 -0.635,-2.8; 4 0.635,-2.8; 5 1.905,-2.8; 6 3.175,-2.8; 7 4.445,-2.8; 8 4.445,2.8; 9 3.175,2.8; 10 1.905,2.8; 11 0.635,2.8; 12 -0.635,2.8; 13 -1.905,2.8; 14 -3.175,2.8
1X01 = drill 1.016 pad 1.93 octagon: 1 0,0
TO-5_V10 = drill 0.8 pad 1.4: 1 -2.7,0; 2 2.7,0
LED5MM = drill 0.813 pad 1.676 octagon: A -1.27,0; K 1.27,0
MIC-9.7MM = drill 0.8 pad 1.676: 1 -2,1.27; 2 -2,-1.27
SO-8 = smd 1.524 x 0.61: 1 -2.743,1.905; 2 -2.743,0.635; 3 -2.743,-0.635; 4 -2.743,-1.905; 5 2.743,-1.905; 6 2.743,-0.635; 7 2.743,0.635; 8 2.743,1.905
R3216 = smd 1.6 x 1.8: 1 -1.4,0; 2 1.4,0
FE06 = drill 0.813 long: 1 -6.35,0; 2 -3.81,0; 3 -1.27,0; 4 1.27,0; 5 3.81,0; 6 6.35,0
SOT23-BEC = smd 1 x 1.4: B -0.95,-1.1; C 0,1.1; E 0.95,-1.1
TC33X = smd 1.2 x 1.2: 1 -1,-1.825; 3 1,-1.825 | smd 1.5 x 1.6: 2 0,1.5
SOT-223 = smd 0.96 x 1.26: 1 -2.3,-3.375; 2 0,-3.375; 3 2.3,-3.375 | smd 3.19 x 1.26: 4 0,3.375
8-SOIC = smd 0.66 x 2.07: 1 -1.905,-2.42; 2 -0.635,-2.42; 3 0.635,-2.42; 4 1.905,-2.42; 5 1.905,2.42; 6 0.635,2.42; 7 -0.635,2.42; 8 -1.905,2.42
GEARMOTOR = drill 0.6 square: P$1 14,-30; P$2 14,-26 | hole 4.5: 16,-6.27; 16,-0.08
8_RES_ISO_SOIC16 = smd 2 x 0.63: P$1 -3.45,4.445; P$2 -3.45,3.175; P$3 -3.45,1.905; P$4 -3.45,0.635; P$5 -3.45,-0.635; P$6 -3.45,-1.905; P$7 -3.45,-3.175; P$8 -3.45,-4.445; P$9 3.45,-4.445; P$10 3.45,-3.175; P$11 3.45,-1.905; P$12 3.45,-0.635; P$13 3.45,0.635; P$14 3.45,1.905; P$15 3.45,3.175; P$16 3.45,4.445
SO18L = smd 0.66 x 2.032: 1 -0.635,-4.902; 2 0.635,-4.902; 3 1.905,-4.902; 4 3.175,-4.902; 5 4.445,-4.902; 6 5.715,-4.902; 7 6.985,-4.902; 8 8.255,-4.902; 9 9.525,-4.902; 10 9.525,4.902; 11 8.255,4.902; 12 6.985,4.902; 13 5.715,4.902; 14 4.445,4.902; 15 3.175,4.902; 16 1.905,4.902; 17 0.635,4.902; 18 -0.635,4.902

### Placement (x,y rotation side)
BT2  69.35,19.62 270 top
C1  65.54,25.33 270 top
C2  68.72,25.33 270 top
C3  38.87,36.03 270 top
C4  89.67,39.84 180 top
C5  69.35,42.38 180 top
C6  79.51,34.76 0 top
C7  97.29,39.84 180 top
C8  41.41,36.03 270 top
C9  38.87,20.79 270 top
C11  46.49,28.41 90 top
D1  50.29,83.64 180 top
D2  50.29,86.18 180 top
D3  50.29,88.72 180 top
D4  50.29,91.26 180 top
D5  50.29,93.8 180 top
D6  50.29,96.34 180 top
D7  75.69,93.8 0 top
D8  75.69,91.26 0 top
D9  75.69,88.72 0 top
D10  75.69,86.18 0 top
D11  75.69,83.64 0 top
D12  75.69,81.1 0 top
D13  87.13,48.73 270 top
D14  92.21,50 90 top
D15  50.3,64.61 180 top
D16  50.3,67.14 180 top
D17  50.3,69.69 180 top
D18  50.3,72.22 180 top
D19  50.3,74.77 180 top
D20  50.3,77.31 180 top
D21  75.7,74.77 0 top
D22  75.7,72.22 0 top
D23  75.7,69.69 0 top
D24  75.7,67.14 0 top
D25  75.7,64.61 0 top
D26  75.7,62.06 0 top
IC1  62.99,88.72 270 top
IC2  79.51,42.38 90 top
IC3  63,69.69 270 top
JP1  24.9,34.76 180 top
JP2  98.56,30.95 0 top
JP3  2.38,90.64 0 top
JP4  110.5,90.64 0 top
JP5  64.27,42.38 90 top
JP6  49.03,13.17 0 top
JP7  111.01,9.36 0 top
JP8  15.25,9.36 0 top
JP9  19.52,96.74 0 top
JP10  93.48,96.74 0 top
JP11  110.75,80.48 90 top
JP12  110.75,19.39 90 top
JP13  93.48,3.65 0 top
JP14  32.52,3.26 0 top
JP15  15.38,19.52 90 top
JP16  2.25,80.48 90 top
LDR_A  4.28,95.72 225 top
LDR_B  108.72,95.72 315 top
LDR_C  108.72,4.28 45 top
LDR_D  17.28,4.28 135 top
LED1  14.44,97.88 0 top
LED2  98.56,97.62 180 top
LED3  110.88,85.56 270 top
LED4  110.88,14.44 90 top
LED5  98.56,2.12 180 top
LED6  27.44,2.12 0 top
LED7  15.25,14.44 90 top
LED8  2.12,85.56 270 top
MIC1  107.45,39.84 0 top
MIC2  42.68,43.65 90 top
Q1  24.9,47.46 90 top
Q2  98.56,18.25 270 top
R1  98.56,25.87 270 top
R2  24.9,39.84 90 top
R3  6.81,89.99 180 top
R4  6.81,87.45 0 top
R7  106.17,79.83 180 top
R8  106.17,77.29 0 top
R11  6.81,84.91 0 top
R12  6.81,82.37 0 top
R13  106.17,82.37 180 top
R14  106.17,84.91 180 top
R39  13.17,94.2 180 top
R40  99.83,94.45 0 top
R41  97.29,42.38 180 top
R42  79.51,50 0 top
R43  89.67,37.3 0 top
R44  69.35,37.3 0 top
R45  79.51,52.54 0 top
R46  46.49,36.03 270 top
R47  64.27,37.3 0 top
R48  69.35,50 180 top
R49  64.27,34.76 0 top
R50  43.95,36.03 90 top
R51  41.41,30.95 270 top
R52  41.41,20.79 90 top
R53  43.95,20.79 90 top
R54  99.83,5.55 0 top
R55  69.35,34.76 180 top
R56  69.35,52.54 0 top
R57  26.17,5.55 180 top
R58  89.67,42.38 0 top
R59  69.35,44.92 180 top
R60  97.29,37.3 180 top
R61  69.35,47.46 0 top
R62  89.67,44.92 0 top
R63  6.82,74.77 180 top
R64  6.82,72.22 0 top
R65  6.82,64.61 180 top
R66  6.82,62.06 0 top
R67  106.18,64.61 180 top
R68  106.18,62.06 0 top
R69  106.18,72.22 0 top
R70  106.18,74.77 180 top
R71  6.82,69.69 0 top
R72  6.82,67.14 0 top
R73  106.18,67.14 180 top
R74  106.18,69.69 180 top
R99  20.6,100.75 0 top
R100  88.4,97.75 180 top
R101  110.75,70.95 270 top
R102  110.62,29.68 90 top
R111  88.4,2.5 180 top
R112  37.6,2.5 0 top
R113  15.25,29.68 90 top
R114  2.25,70.32 270 top
SV1  55.37,89.99 90 top
SV2  70.61,87.45 270 top
SV3  55.25,70.95 90 top
SV4  70.62,68.41 270 top
T1  41.41,25.87 180 top
TM1  8.09,94.45 0 top
TM2  104.91,94.45 0 top
TM3  97.29,50 270 top
TM4  49.03,20.79 180 top
TM5  104.91,5.55 180 top
TM6  21.09,5.55 180 top
U1  60.46,27.24 0 top
U2  41.41,13.17 180 top
U$1  9.36,60.16 0 top
U$2  103.64,60.16 0 bottom
U$3  41,90 0 top
U$4  109,88 180 top
U$5  12,71 180 top
U$6  102,71 0 top
U$7  85,89 180 top
U$8  -55,-3 0 top  (outside the outline)
U$9  15,87 0 top
U$10  -65,-3 0 top  (outside the outline)
U$11  -75,-3 0 top  (outside the outline)
ULN1  28.05,93.9 270 top
ULN2  96.93,83 90 top
ULN3  90.94,66.51 90 top
ULN4  22.06,75.38 270 top

### Tracks (layer width: path | path; a pad name or v marks a point on that pad's centre or on a via)
40XX_CH_A_IN_A  (3 unrouted)
40XX_CH_A_IN_B  (3 unrouted)
40XX_CH_A_OUT  (3 unrouted)
40XX_CH_B_IN_A  (3 unrouted)
40XX_CH_B_IN_B  (3 unrouted)
40XX_CH_B_OUT  (3 unrouted)
40XX_CH_C_IN_A  (3 unrouted)
40XX_CH_C_IN_B  (3 unrouted)
40XX_CH_C_OUT  (3 unrouted)
40XX_CH_D_IN_A  (3 unrouted)
40XX_CH_D_IN_B  (3 unrouted)
40XX_CH_D_OUT  (3 unrouted)
40XX_CH_E_IN_A  (3 unrouted)
40XX_CH_E_IN_B  (3 unrouted)
40XX_CH_E_OUT  (3 unrouted)
40XX_CH_F_IN_A  (3 unrouted)
40XX_CH_F_IN_B  (3 unrouted)
40XX_CH_F_OUT  (3 unrouted)
40XX_CH_G_IN_A  (3 unrouted)
40XX_CH_G_IN_B  (3 unrouted)
40XX_CH_G_OUT  (3 unrouted)
40XX_CH_H_IN_A  (3 unrouted)
40XX_CH_H_IN_B  (3 unrouted)
40XX_CH_H_OUT  (3 unrouted)
AMPENV  (2 unrouted)
GND  (65 unrouted)
  pour Bottom (isolate 0.152): -3.34,104.34 -3.34,-3.34 116.34,-3.34 116.34,104.34
  pour Top (isolate 0.152): -8.42,108.42 -8.42,-8.42 121.42,-8.42 121.42,108.42
LED_CH_A_IN  (1 unrouted)
LED_CH_A_OUT  (1 unrouted)
LED_CH_B_IN  (1 unrouted)
LED_CH_B_OUT  (1 unrouted)
LED_CH_C_IN  (1 unrouted)
LED_CH_C_OUT  (1 unrouted)
LED_CH_D_IN  (1 unrouted)
LED_CH_D_OUT  (1 unrouted)
LED_CH_E_IN  (1 unrouted)
LED_CH_E_OUT  (1 unrouted)
LED_CH_F_IN  (1 unrouted)
LED_CH_F_OUT  (1 unrouted)
LED_CH_G_IN  (1 unrouted)
LED_CH_G_OUT  (1 unrouted)
LED_CH_H_IN  (1 unrouted)
LED_CH_H_OUT  (1 unrouted)
LIGHT_SENSOR_A_OUT  (2 unrouted)
LIGHT_SENSOR_B_OUT  (2 unrouted)
LIGHT_SENSOR_C_OUT  (2 unrouted)
LIGHT_SENSOR_D_OUT  (2 unrouted)
MOTOR_A-  (4 unrouted)
MOTOR_B-  (4 unrouted)
N$  (2 unrouted)
N$5  (1 unrouted)
N$6  (1 unrouted)
N$7  (1 unrouted)
N$8  (1 unrouted)
N$9  (1 unrouted)
N$10  (1 unrouted)
N$11  (1 unrouted)
N$12  (1 unrouted)
N$13  (1 unrouted)
N$14  (1 unrouted)
N$15  (1 unrouted)
N$16  (1 unrouted)
N$17  (1 unrouted)
N$18  (1 unrouted)
N$19  (1 unrouted)
N$20  (1 unrouted)
N$21  (1 unrouted)
N$22  (1 unrouted)
N$23  (1 unrouted)
N$24  (1 unrouted)
N$25  (1 unrouted)
N$26  (1 unrouted)
N$27  (1 unrouted)
N$28  (1 unrouted)
N$29  (1 unrouted)
N$30  (1 unrouted)
N$31  (1 unrouted)
N$32  (1 unrouted)
N$33  (1 unrouted)
N$34  (1 unrouted)
N$35  (1 unrouted)
N$36  (1 unrouted)
N$37  (1 unrouted)
N$38  (1 unrouted)
N$39  (1 unrouted)
N$40  (1 unrouted)
N$41  (1 unrouted)
N$42  (1 unrouted)
N$44  (1 unrouted)
N$45  (1 unrouted)
N$46  (2 unrouted)
N$47  (2 unrouted)
N$48  (2 unrouted)
N$49  (1 unrouted)
N$50  (1 unrouted)
N$51  (3 unrouted)
N$52  (1 unrouted)
N$53  (3 unrouted)
N$54  (3 unrouted)
N$55  (1 unrouted)
N$56  (2 unrouted)
N$57  (2 unrouted)
N$58  (2 unrouted)
N$59  (1 unrouted)
N$60  (4 unrouted)
N$62  (2 unrouted)
N$63  (3 unrouted)
N$64  (1 unrouted)
N$65  (2 unrouted)
N$67  (1 unrouted)
N$68  (1 unrouted)
N$69  (1 unrouted)
N$70  (1 unrouted)
N$71  (1 unrouted)
N$74  (1 unrouted)
N$75  (1 unrouted)
N$76  (1 unrouted)
N$77  (1 unrouted)
N$78  (1 unrouted)
N$79  (1 unrouted)
N$80  (1 unrouted)
N$81  (1 unrouted)
N$82  (1 unrouted)
N$83  (1 unrouted)
N$84  (1 unrouted)
N$85  (1 unrouted)
N$86  (1 unrouted)
N$87  (1 unrouted)
N$88  (1 unrouted)
N$89  (1 unrouted)
N$90  (1 unrouted)
N$91  (1 unrouted)
N$92  (1 unrouted)
N$93  (1 unrouted)
N$94  (1 unrouted)
N$95  (1 unrouted)
N$96  (1 unrouted)
N$97  (1 unrouted)
N$98  (1 unrouted)
N$99  (1 unrouted)
N$100  (1 unrouted)
N$101  (1 unrouted)
N$102  (1 unrouted)
N$103  (1 unrouted)
N$104  (1 unrouted)
N$105  (1 unrouted)
N$106  (1 unrouted)
N$107  (1 unrouted)
N$108  (1 unrouted)
N$109  (1 unrouted)
N$111  (1 unrouted)
N$112  (1 unrouted)
N$113  (1 unrouted)
N$114  (1 unrouted)
N$115  (1 unrouted)
N$116  (1 unrouted)
N$117  (1 unrouted)
N$118  (1 unrouted)
N$119  (1 unrouted)
N$120  (1 unrouted)
N$121  (1 unrouted)
N$122  (1 unrouted)
N$123  (1 unrouted)
N$124  (1 unrouted)
N$125  (1 unrouted)
N$126  (1 unrouted)
VBAT  (2 unrouted)
VDD  (58 unrouted)

### Text on the board
_tsilk: BattleBitsPCB V1.0 | Designed by Jelle Reith / Jellereith.nl | January 2021
_bsilk: BattleBitsPCB V1.0 / Designed by Jelle Reith / Jellereith.nl / January 2021